# EAGLE design CANBridge (EAGLE 6.5.0)
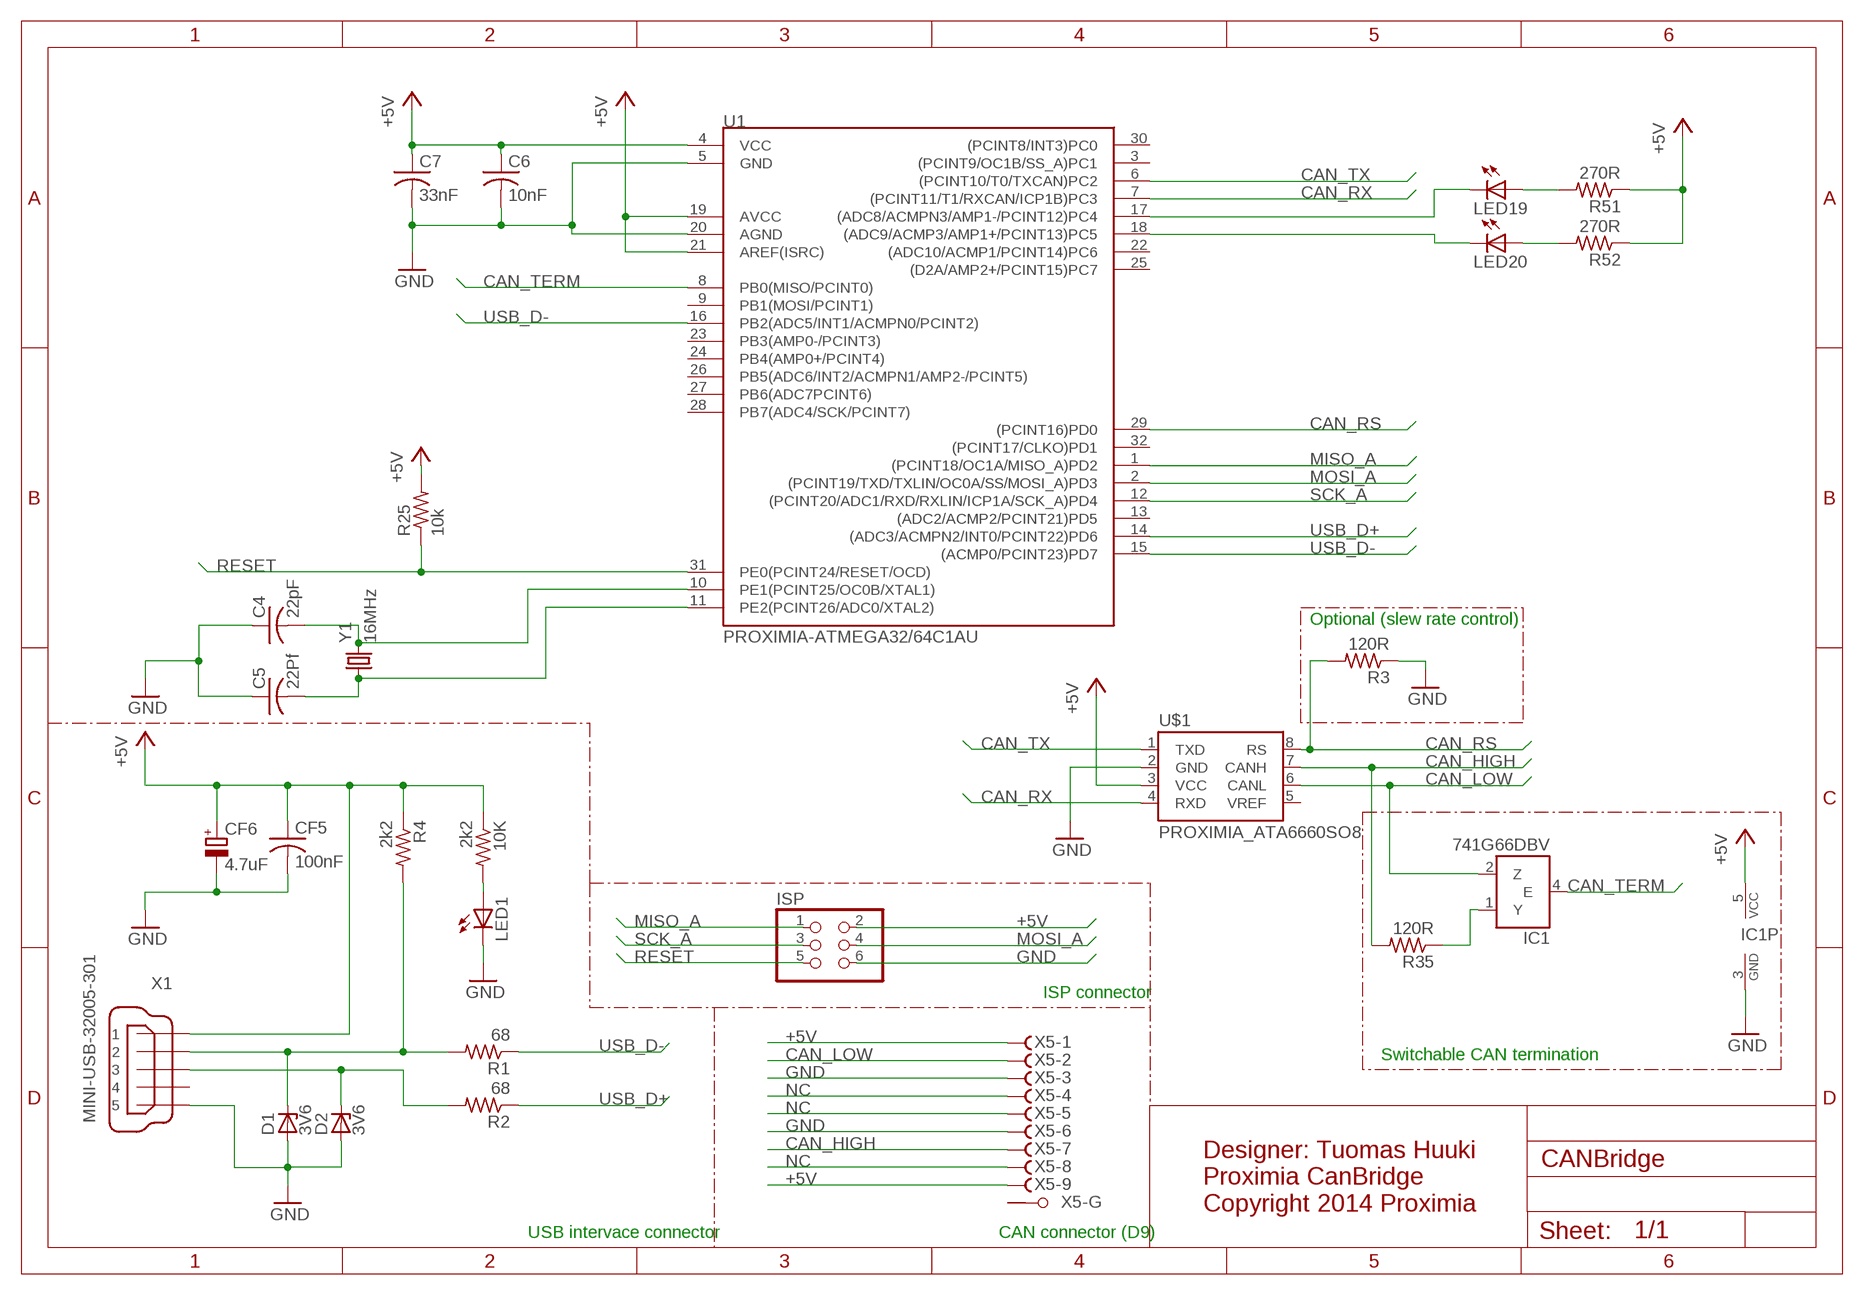
[diagram p0: schematic, sheet 1]

## Parts
10K  2k2  R-US_R0603  [R0603]
C4  22pF  C-USC0603  [C0603]
C5  22Pf  C-USC0603  [C0603]
C6  10nF  C-USC0603  [C0603]
C7  33nF  C-USC0603  [C0603]
CF5  100nF  C-USC0603  [C0603]
CF6  4.7uF  CPOL-EUB  [PANASONIC_B]
D1  3V6  ZENER-DIODESOD80C  [SOD80C]
D2  3V6  ZENER-DIODESOD80C  [SOD80C]
IC1  741G66DBV  [SOT23-5]
ISP  PINHD-2X3  [2X03]
LED1  LEDSML1206  [SML1206]
LED19  LEDSML1206  [SML1206]
LED20  LEDSML1206  [SML1206]
R1  68  R-US_R0603  [R0603]
R2  68  R-US_R0603  [R0603]
R3  120R  R-US_R0603  [R0603]
R4  2k2  R-US_R0603  [R0603]
R25  10k  R-US_R0603  [R0603]
R35  120R  R-US_R0603  [R0603]
R51  270R  R-US_R0603  [R0603]
R52  270R  R-US_R0603  [R0603]
U1  PROXIMIA-ATMEGA32/64C1AU  [PROXIMIA_TQFP32-08]
U$1  PROXIMIA_ATA6660SO8  [PROXIMIA_SO08]
X1  MINI-USB-32005-301  [32005-301]
X5  F09HPS  [F09HP]
Y1  16MHz  CRYSTAL5X3  [CRYSTAL-SMD-5X3]

## Nets
+5V: 10K.1 C6.1 C7.1 CF5.1 CF6.+ IC1.5(VCC) ISP.2 R4.1 R25.2 R51.1 R52.1 U1.4(VCC) U1.19(AVCC) U1.21(AREF(ISRC)) U$1.3(VCC) X1.1 X5.1(-1:F) X5.9(-9:F)
CAN_HIGH: R35.2 U$1.7(CANH) X5.7(-7:F)
CAN_LOW: IC1.2(Z) U$1.6(CANL) X5.2(-2:F)
CAN_RS: R3.2 U1.29((PCINT16)PD0) U$1.8(RS)
CAN_RX: U1.7((PCINT11/T1/RXCAN/ICP1B)PC3) U$1.4(RXD)
CAN_TERM: IC1.4(E) U1.8(PB0(MISO/PCINT0))
CAN_TX: U1.6((PCINT10/T0/TXCAN)PC2) U$1.1(TXD)
GND: C4.1 C5.1 C6.2 C7.2 CF5.2 CF6.- D1.A D2.A IC1.3(GND) ISP.6 LED1.C R3.1 U1.5(GND) U1.20(AGND) U$1.2(GND) X1.5 X5.3(-3:F) X5.6(-6:F)
MISO_A: ISP.1 U1.1((PCINT18/OC1A/MISO_A)PD2)
MOSI_A: ISP.4 U1.2((PCINT19/TXD/TXLIN/OC0A/SS/MOSI_A)PD3)
N$1: 10K.2 LED1.A
N$3: D1.C R1.2 R4.2 X1.2
N$4: D2.C R2.2 X1.3
N$43: C4.2 U1.10(PE1(PCINT25/OC0B/XTAL1)) Y1.3
N$44: C5.2 U1.11(PE2(PCINT26/ADC0/XTAL2)) Y1.1
N$45: IC1.1(Y) R35.1
N$87: LED19.A R51.2
N$88: LED20.A R52.2
N$89: LED19.C U1.17((ADC8/ACMPN3/AMP1-/PCINT12)PC4)
N$90: LED20.C U1.18((ADC9/ACMP3/AMP1+/PCINT13)PC5)
NC: X5.4(-4:F) X5.5(-5:F) X5.8(-8:F)
RESET: ISP.5 R25.1 U1.31(PE0(PCINT24/RESET/OCD))
SCK_A: ISP.3 U1.12((PCINT20/ADC1/RXD/RXLIN/ICP1A/SCK_A)PD4)
USB_D+: R2.1 U1.14((ADC3/ACMPN2/INT0/PCINT22)PD6)
USB_D-: R1.1 U1.15((ACMP0/PCINT23)PD7) U1.16(PB2(ADC5/INT1/ACMPN0/PCINT2))
Unconnected: U1.3((PCINT9/OC1B/SS_A)PC1) U1.9(PB1(MOSI/PCINT1)) U1.13((ADC2/ACMP2/PCINT21)PD5) U1.22((ADC10/ACMP1/PCINT14)PC6) U1.23(PB3(AMP0-/PCINT3)) U1.24(PB4(AMP0+/PCINT4)) U1.25((D2A/AMP2+/PCINT15)PC7) U1.26(PB5(ADC6/INT2/ACMPN1/AMP2-/PCINT5)) U1.27(PB6(ADC7PCINT6)) U1.28(PB7(ADC4/SCK/PCINT7)) U1.30((PCINT8/INT3)PC0) U1.32((PCINT17/CLKO)PD1) U$1.5(VREF) X1.4 X5.G1(-G:G1) X5.G2(-G:G2)

## Notes on the sheet
- Optional (slew rate control)
- ISP connector
- Switchable CAN termination
- Designer: Tuomas Huuki 
  Proximia CanBridge
  Copyright 2014 Proximia
- USB intervace connector | CAN connector (D9)

## Library data of the parts
10K R1 R2 R4 R51 R52 = rcl:R-US_: RESISTOR, American symbol
C4 C5 CF5 = rcl:C-US: CAPACITOR, American symbol
C6 C7 = resistor:C-US: CAPACITOR, American symbol
CF6 = resistor:CPOL-EU: POLARIZED CAPACITOR, European symbol
D1 D2 = diode:ZENER-DIODE: Z-Diode
IC1 = 74xx-little-de:74*1G66: Single Analog / Bilateral Switch Source: http://www.semiconductors.philips.com/acrobat_download/datasheets/74HC_HCT1G66_3.pdf
ISP = pinhead:PINHD-2X3: PIN HEADER
LED1 LED19 LED20 = led:LED: LED OSRAM: - CHIPLED LG R971, LG N971, LY N971, LG Q971, LY Q971, LO R971, LY R971 LH N974, LH R974 LS Q976, LO Q976, LY Q976 LO Q996 - Hyper CHIPLED LW Q18S LB Q993, LB Q99A, LB R99A - SideLED LS A670, LO A670, LY A670, LG A670, LP A670 LB A673, LV A673, LT A673, LW A673 LH A674 LY A675 LS A676, LA A676, LO A676, LY A676, LW A676 LS A679, LY A679, LG A679 - Hyper Micro SIDELED® LS Y876, LA Y876, LO Y876, LY Y876 LT Y87S - SmartLED LW L88C, LW L88S LB L89C, LB L89S, LG L890 LS L89K, LO L89K, LY L89K LS L896, LA L896, LO L896, LY L896 - TOPLED LS T670, LO T670, LY T670, LG T670, LP T670 LSG T670, LSP T670, LSY T670, LOP T670, LYG T670 LG T671, LOG T671, LSG T671 LB T673, LV T673, LT T673, LW T673 LH T674 LS T676, LA T676, LO T676, LY T676, LB T676, LH T676, LSB T676, LW T676 LB T67C, LV T67C, LT T67C, LS T67K, LO T67K, LY T67K, LW E67C LS E67B, LA E67B, LO E67B, LY E67B, LB E67C, LV E67C, LT E67C LW T67C LS T679, LY T679, LG T679 LS T770, LO T770, LY T770, LG T770, LP T770 LB T773, LV T773, LT T773, LW T773 LH T774 LS E675, LA E675, LY E675, LS T675 LS T776, LA T776, LO T776, LY T776, LB T776 LHGB T686 LT T68C, LB T68C - Hyper Mini TOPLED® LB M676 - Mini TOPLED Santana® LG M470 LS M47K, LO M47K, LY M47K Source: http://www.osram.convergy.de LUXEON: - LUMILED® LXK2-PW12-R00, LXK2-PW12-S00, LXK2-PW14-U00, LXK2-PW14-V00 LXK2-PM12-R00, LXK2-PM12-S00, LXK2-PM14-U00 LXK2-PE12-Q00, LXK2-PE12-R00, LXK2-PE12-S00, LXK2-PE14-T00, LXK2-PE14-U00 LXK2-PB12-K00, LXK2-PB12-L00, LXK2-PB12-M00, LXK2-PB14-N00, LXK2-PB14-P00, LXK2-PB14-Q00 LXK2-PR12-L00, LXK2-PR12-M00, LXK2-PR14-Q00, LXK2-PR14-R00 LXK2-PD12-Q00, LXK2-PD12-R00, LXK2-PD12-S00 LXK2-PH12-R00, LXK2-PH12-S00 LXK2-PL12-P00, LXK2-PL12-Q00, LXK2-PL12-R00 Source: www.luxeon.com KINGBRIGHT: KA-3528ASYC Source: www.kingbright.com
R3 R25 R35 = resistor:R-US_: RESISTOR, American symbol
U1 = proximia_atmega32-64C1:PROXIMIA-ATMEGA32/64C1: Atmel 32-pin 8-bit Microcontroller with 8/16/32K Bystes of ISP Flash and CAN Controller. ATmeg32C1, ATmega64C1
U$1 = proximia_ata6660:PROXIMIA_ATA6660: High-speed Can Transceiver.
X1 = con-cypressindustries:MINI-USB-: MINI USB-B Conector Source: www.cypressindustries.com; OC_FARNELL: unknown; OC_NEWARK: unknown
X5 = con-subd:F09HPS: SUB-D; OC_FARNELL: unknown; OC_NEWARK: unknown
Y1 = SparkFun-FreqCtrl:CRYSTAL: Various standard crystals. Proven footprints. Spark Fun Electronics SKU : COM-00534

## Board
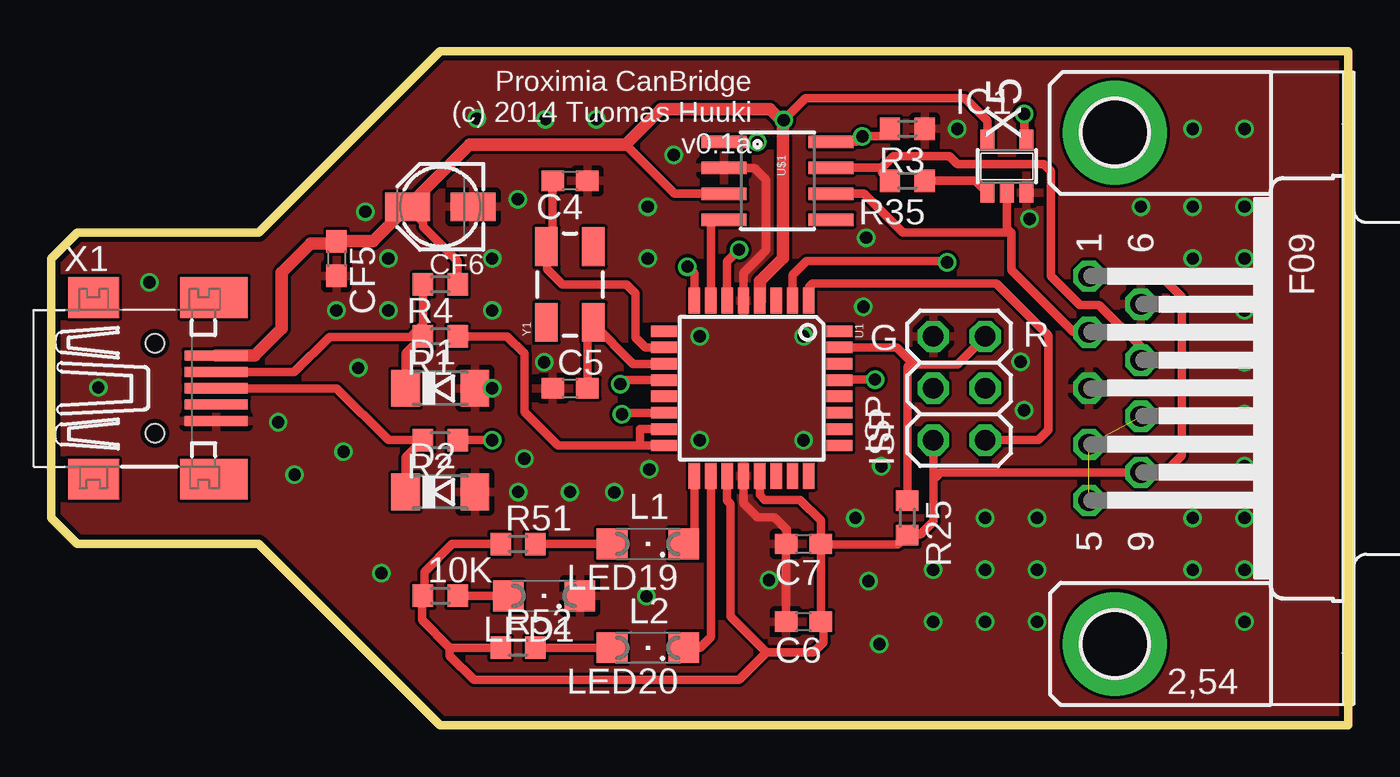
[diagram p1: board, top side]
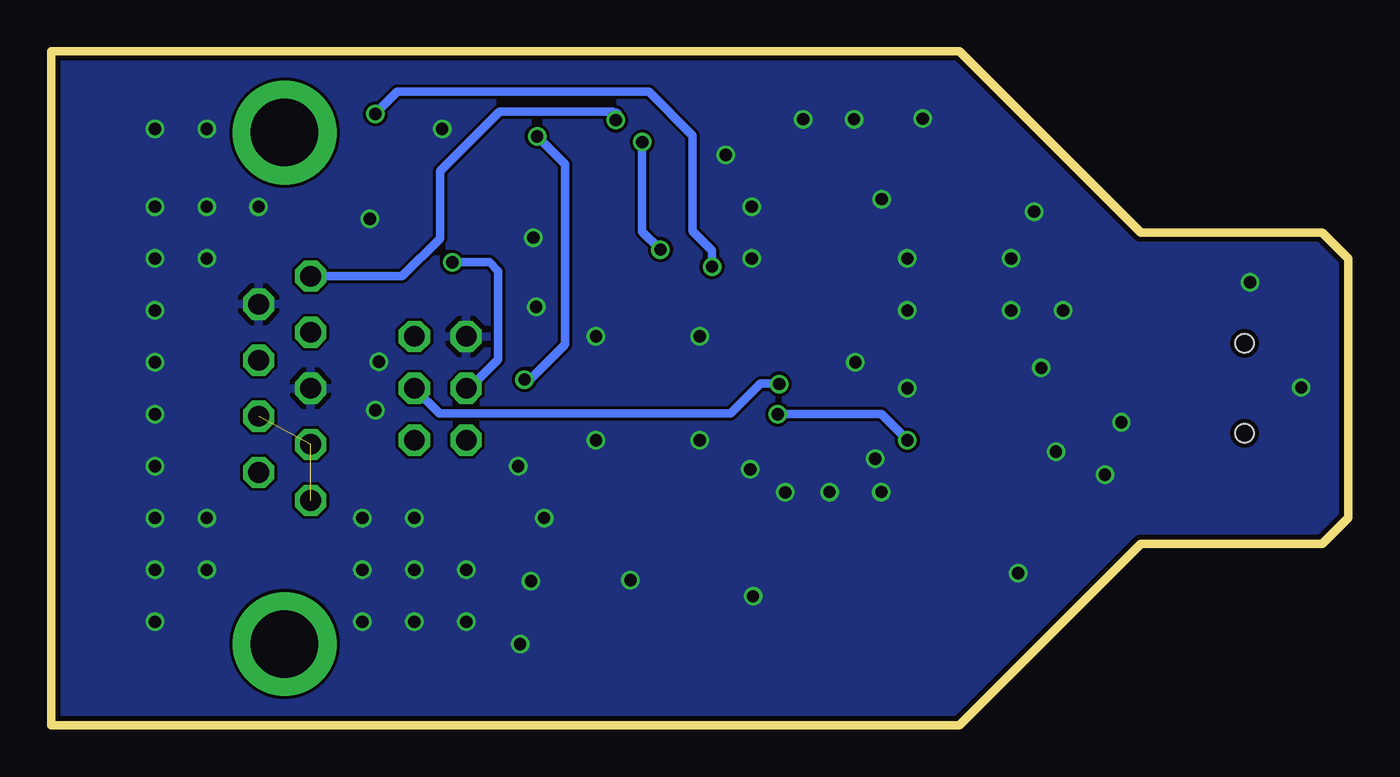
[diagram p2: board, bottom side, seen from below]

Size 63.5 x 33.02 mm. Coordinates in mm from the lower left corner, seen from the top.
Outline: 1.27,8.89 10.16,8.89 19.05,0 63.5,0 63.5,33.02 19.05,33.02 10.16,24.13 1.27,24.13 0,22.86 0,10.16 1.27,8.89
Copper layers (1*16): Top 0.035mm / dielectric 1.5mm / Bottom 0.035mm
Design rules "ITEADstudio_DRC": minimum track width 6mil, minimum drill 12mil, track to track 6mil, track to pad 6mil, pad to pad 6mil, via to via 6mil, smd to smd 0mil, copper to edge 10mil, drill to drill 10mil, minimum pad ring 10mil, minimum via ring 6mil, stop-mask expansion 2mil, vias tented up to drill 100mil, thermal gap 10mil

### Footprints (pad centres in the part's own frame; a part is rotated, then mirrored left to right if it is on the bottom)
R0603 = smd 1 x 1.1: 1 -0.85,0; 2 0.85,0
C0603 = smd 1.1 x 1: 1 -0.85,0; 2 0.85,0
PANASONIC_B = smd 2.2 x 1.4: + 1.6,0; - -1.6,0
SOD80C = smd 1.4 x 1.8: A 1.7,0; C -1.7,0
SOT23-5 = smd 0.69 x 0.99: 1 -0.95,-1.29; 2 0,-1.29; 3 0.95,-1.29; 4 0.95,1.3; 5 -0.95,1.3
2X03 = drill 1.016 octagon: 1 -2.54,-1.27; 2 -2.54,1.27; 3 0,-1.27; 4 0,1.27; 5 2.54,-1.27; 6 2.54,1.27
SML1206 = smd 1.5 x 1.5: A 1.75,0; C -1.75,0
PROXIMIA_TQFP32-08 = smd 1.27 x 0.559: 1 -4.293,2.8; 2 -4.293,2; 3 -4.293,1.2; 4 -4.293,0.4; 5 -4.293,-0.4; 6 -4.293,-1.2; 7 -4.293,-2; 8 -4.293,-2.8; 17 4.293,-2.8; 18 4.293,-2; 19 4.293,-1.2; 20 4.293,-0.4; 21 4.293,0.4; 22 4.293,1.2; 23 4.293,2; 24 4.293,2.8 | smd 0.559 x 1.27: 9 -2.8,-4.293; 10 -2,-4.293; 11 -1.2,-4.293; 12 -0.4,-4.293; 13 0.4,-4.293; 14 1.2,-4.293; 15 2,-4.293; 16 2.8,-4.293; 25 2.8,4.293; 26 2,4.293; 27 1.2,4.293; 28 0.4,4.293; 29 -0.4,4.293; 30 -1.2,4.293; 31 -2,4.293; 32 -2.8,4.293
PROXIMIA_SO08 = smd 0.61 x 2.21: 1 -1.905,-2.616; 2 -0.635,-2.616; 3 0.635,-2.616; 4 1.905,-2.616; 5 1.905,2.616; 6 0.635,2.616; 7 -0.635,2.616; 8 -1.905,2.616
32005-301 = smd 3.1 x 0.5: 1 3,1.6; 2 3,0.8; 3 3,0; 4 3,-0.8; 5 3,-1.6 | smd 2.5 x 2: M1 -3,-4.45; M2 -3,4.45 | smd 3.3 x 2: M3 2.9,4.45; M4 2.9,-4.45 | hole 0.9: 0,2.2; 0,-2.2
F09HP = drill 1.016 octagon: 1 -5.486,-1.27; 2 -2.743,-1.27; 3 0,-1.27; 4 2.743,-1.27; 5 5.486,-1.27; 6 -4.115,1.27; 7 -1.372,1.27; 8 1.372,1.27; 9 4.115,1.27 | drill 3.302 pad 5.08: G1 -12.522,0; G2 12.522,0
CRYSTAL-SMD-5X3 = smd 1.9 x 1.1: 1 -1.85,-1.15; 2 1.85,-1.15; 3 1.85,1.15; 4 -1.85,1.15

### Placement (x,y rotation side)
10K  19.05,6.35 0 top
C4  25.4,26.67 180 top
C5  25.4,16.51 0 top
C6  36.83,5.08 180 top
C7  36.83,8.89 180 top
CF5  13.97,22.86 270 top
CF6  19.05,25.4 180 top
D1  19.05,16.51 0 top
D2  19.05,11.43 0 top
IC1  46.78,27.38 0 top
ISP  44.45,16.51 90 top
LED1  24.13,6.35 180 top
LED19  29.21,8.89 180 top
LED20  29.21,3.81 180 top
R1  19.05,19.05 180 top
R2  19.05,13.97 180 top
R3  41.91,29.21 180 top
R4  19.05,21.59 180 top
R25  41.91,10.16 270 top
R35  41.91,26.67 180 top
R51  22.86,8.89 0 top
R52  22.86,3.81 0 top
U1  34.29,16.51 270 top
U$1  35.56,26.67 270 top
X1  5.08,16.51 0 top
X5  52.07,16.51 270 top
Y1  25.4,21.59 90 top

### Tracks (layer width: path | path; a pad name or v marks a point on that pad's centre or on a via)
+5V  (via drill 0.6)
  Top 0.406: 13.88,23.62 CF5.1 | 19.85,21.64 R4.1 19.9,22.73 18.2,24.43 18.2,24.65 CF6.+ | 28.11,28.43 30.5,26.04 U$1.3 | C7.1 37.71,8.86 41.46,8.86 R25.2 | R25.2 42.05,9.45 | 35.84,29.63 v35.85,29.64 36.93,30.71 44.73,30.71 45.83,29.61 IC1.5 | U1.21 34.69,11.28 34.91,11.05 36.66,11.05 37.67,10.05 C7.1 | X5.1 54.32,22 55.35,20.97 55.35,13.23 54.61,12.49 53.43,12.49 X5.9 43.52,12.39 43.18,12.05 | C7.1 C6.1 37.82,4.94 37.82,4.07 37.33,3.58 35.02,3.58 | ISP.2 43.18,12.05 | 43.18,12.05 43.18,9.99 42.55,9.36 41.96,9.36 R25.2 | R51.1 19.64,8.89 18.27,7.52 18.27,6.42 10K.1 18.16,6.31 18.16,5.16 19.52,3.81 | 19.52,3.81 R52.1 | U1.19 33.09,11.02 33.26,10.85 33.26,5.34 35.02,3.58 | 19.52,3.81 19.52,3.41 20.69,2.24 33.67,2.24 35.02,3.58
  Top 0.61: X1.1 9.97,18.11 11.29,19.43 11.29,22.18 12.7,23.59 13.86,23.59 CF5.1 15.76,23.71 CF6.+ 20.48,28.43 28.11,28.43 29.84,30.17 35.19,30.17 35.72,29.64 v35.85,29.64 35.83,29.61 35.83,22.89 34.69,21.75 U1.4
  Bottom 0.406: X5.1 46.31,22 44.46,23.84 44.46,27.15 41.56,30.05 36,30.05 35.85,29.91
  Bottom 0.61: 35.85,29.91 v35.85,29.64
CAN_HIGH
  Top 0.406: X5.7 53.34,18.54 51.29,20.59 50.35,20.59 48.93,22.01 48.93,27.14 48.59,27.49 44.37,27.49 43.97,27.89 41.24,27.89 40.66,27.3 | U$1.7 40.66,27.3 | 40.66,27.3 40.66,27.07 R35.2
CAN_LOW
  Top 0.406: U$1.6 38.21,26 39,26 39.03,26.04 39.8,26.04 41.7,24.13 46.99,24.13 | X5.2 50.04,19.25 46.99,22.3 46.99,24.13 | IC1.2 46.78,24.34 46.99,24.13
CAN_RS  (via drill 0.6)
  Top 0.406: U1.29 38.61,16.93 v40.33,16.93 | U$1.8 39.44,28.57 v39.71,28.85 40.28,28.85 40.29,28.86 40.72,28.86 R3.2
  Bottom 0.406: v40.33,16.93 40.05,16.93 38.34,18.64 38.34,27.48 v39.71,28.85
CAN_RX
  Top 0.406: U1.7 32.29,24.77 U$1.4
CAN_TERM  (via drill 0.6)
  Top 0.406: U1.8 31.49,22.12 v31.15,22.46 | v47.63,29.95 47.63,28.78 IC1.4
  Bottom 0.406: v31.15,22.46 31.15,23.25 32.11,24.21 32.11,28.89 34.24,31.02 46.56,31.02 v47.63,29.95
CAN_TX  (via drill 0.6)
  Top 0.406: U1.6 33.09,22.71 v33.67,23.3 | v34.56,28.57 32.95,28.57 U$1.1
  Bottom 0.406: v33.67,23.3 | v34.56,28.57 34.56,24.19 v33.67,23.3
GND  (via drill 0.6)
  Top 0.406: U1.5 33.89,22.15 34.54,22.8 34.54,22.82 34.99,23.27 34.99,26.72 34.42,27.3 32.95,27.3 U$1.2 | U1.20 33.89,10.88 34.58,10.19 35.41,10.19 36.02,9.58 36.02,8.93 C7.2 | 36.01,8.92 C7.2 | C7.2 C6.2
  other vias: 21.59,16.51 24.13,17.78 16.51,20.32 13.97,20.32 16.51,22.86 21.59,22.86 21.59,20.32 29.21,22.86 29.21,25.4 30.48,27.94 55.88,29.21 58.42,29.21 58.42,25.4 55.88,25.4 53.34,25.4 55.88,22.86 58.42,22.86 58.42,20.32 58.42,17.78 58.42,15.24 58.42,12.7 58.42,10.16 58.42,7.62 58.42,5.08 55.88,7.62 55.88,10.16 48.26,10.16 48.26,7.62 48.26,5.08 45.72,5.08 45.72,7.62 45.72,10.16 43.18,5.08 43.18,7.62 40.64,12.7 39.37,10.16 22.86,11.43 25.4,11.43 31.75,13.97 31.75,19.05 36.83,19.05 36.83,13.97 26.68,29.68 24.2,29.68 20.84,29.71 15.38,25.16 11.11,14.85 14.32,13.41 11.92,12.27 16.17,7.46 23.17,13.06 29.27,12.54 29.14,6.32 40.54,3.99 39.76,20.49 47.45,17.81 47.63,15.44 22.84,25.77 4.81,21.69 2.31,16.55 39.9,23.88 35.14,7.12 40.01,7.07 27.57,11.41 15.03,17.51 47.89,24.8 44.36,29.21
  pour Bottom: 10.16,8.89 19.05,0 63.5,0 63.5,33.02 19.05,33.02 10.16,24.13 1.27,24.13 0,22.86 0,10.16 1.27,8.89
  pour Top: 10.16,8.89 19.05,0 63.5,0 63.5,33.02 19.05,33.02 10.16,24.13 1.27,24.13 0,22.86 0,10.16 1.27,8.89
MISO_A
  Top 0.406: ISP.1 48.33,13.97 48.82,14.46 48.82,19.1 46.28,21.64 37.27,21.64 37.09,21.46 U1.1
MOSI_A  (via drill 0.6)
  Top 0.406: U1.2 36.29,22.06 36.96,22.73 43.81,22.73 v43.86,22.68
  Bottom 0.406: ISP.4 43.18,16.53 43.02,16.53 41.63,17.92 41.63,22.26 42.05,22.68 v43.86,22.68
N$1
  Top 0.406: LED1.A 10K.2
N$3
  Top 0.406: X1.2 11.91,17.31 13.62,19.03 17.6,19.03 | 17.6,19.03 18.18,19.03 R1.2 17.35,18.2 D1.C | R4.2 18.2,19.63 17.6,19.03
N$4
  Top 0.406: X1.3 13.97,16.51 16.51,13.97 R2.2 17.35,13.12 D2.C
N$43
  Top 0.406: U1.10 29.1,18.51 28.62,18.99 28.62,21.15 28.18,21.59 25.02,21.59 24.27,22.35 24.27,23.42 Y1.3 24.55,23.74 C4.2
N$44
  Top 0.406: U1.11 28.48,17.71 26.55,19.64 Y1.1 26.25,19.44 C5.2
N$45
  Top 0.406: R35.1 45.25,26.67 IC1.1
N$87
  Top 0.406: R51.2 LED19.A
N$88
  Top 0.406: R52.2 LED20.A
N$89
  Top 0.406: U1.17 31.49,9.63 LED19.C
N$90
  Top 0.406: U1.18 32.29,4.35 31.75,3.81 LED20.C
NC  (2 unrouted)
RESET
  Top 0.406: ISP.5 44.35,17.68 42.23,17.68 42.13,17.78 | R25.1 41.91,17.56 42.13,17.78 | U1.31 41.4,18.51 42.13,17.78
SCK_A  (via drill 0.6)
  Top 0.406: U1.12 28.06,16.91 v27.86,16.71
  Bottom 0.406: ISP.3 44.48,15.27 30.24,15.27 28.77,16.74 27.89,16.74 v27.86,16.71
USB_D+  (via drill 0.6)
  Top 0.406: U1.14 28.01,15.31 v27.94,15.24 | v21.59,13.97 R2.1
  Bottom 0.406: v27.94,15.24 22.86,15.24 v21.59,13.97
USB_D-
  Top 0.406: U1.16 28.82,13.71 | 28.82,13.71 24.81,13.71 23.17,15.34 23.17,18.2 22.32,19.05 R1.1 | R1.1 | U1.15 28.82,14.51 28.82,13.71

### Text on the board
_tplace: Proximia CanBridge / (c) 2014 Tuomas Huuki / v0.1a | 1 | 6 | G | R | ISP | L1 | 5 | 9 | L2